# EAGLE design BOB v0.6 (EAGLE 6.1)

## Sheet 1 of 2: Pi Cam Daughterboard
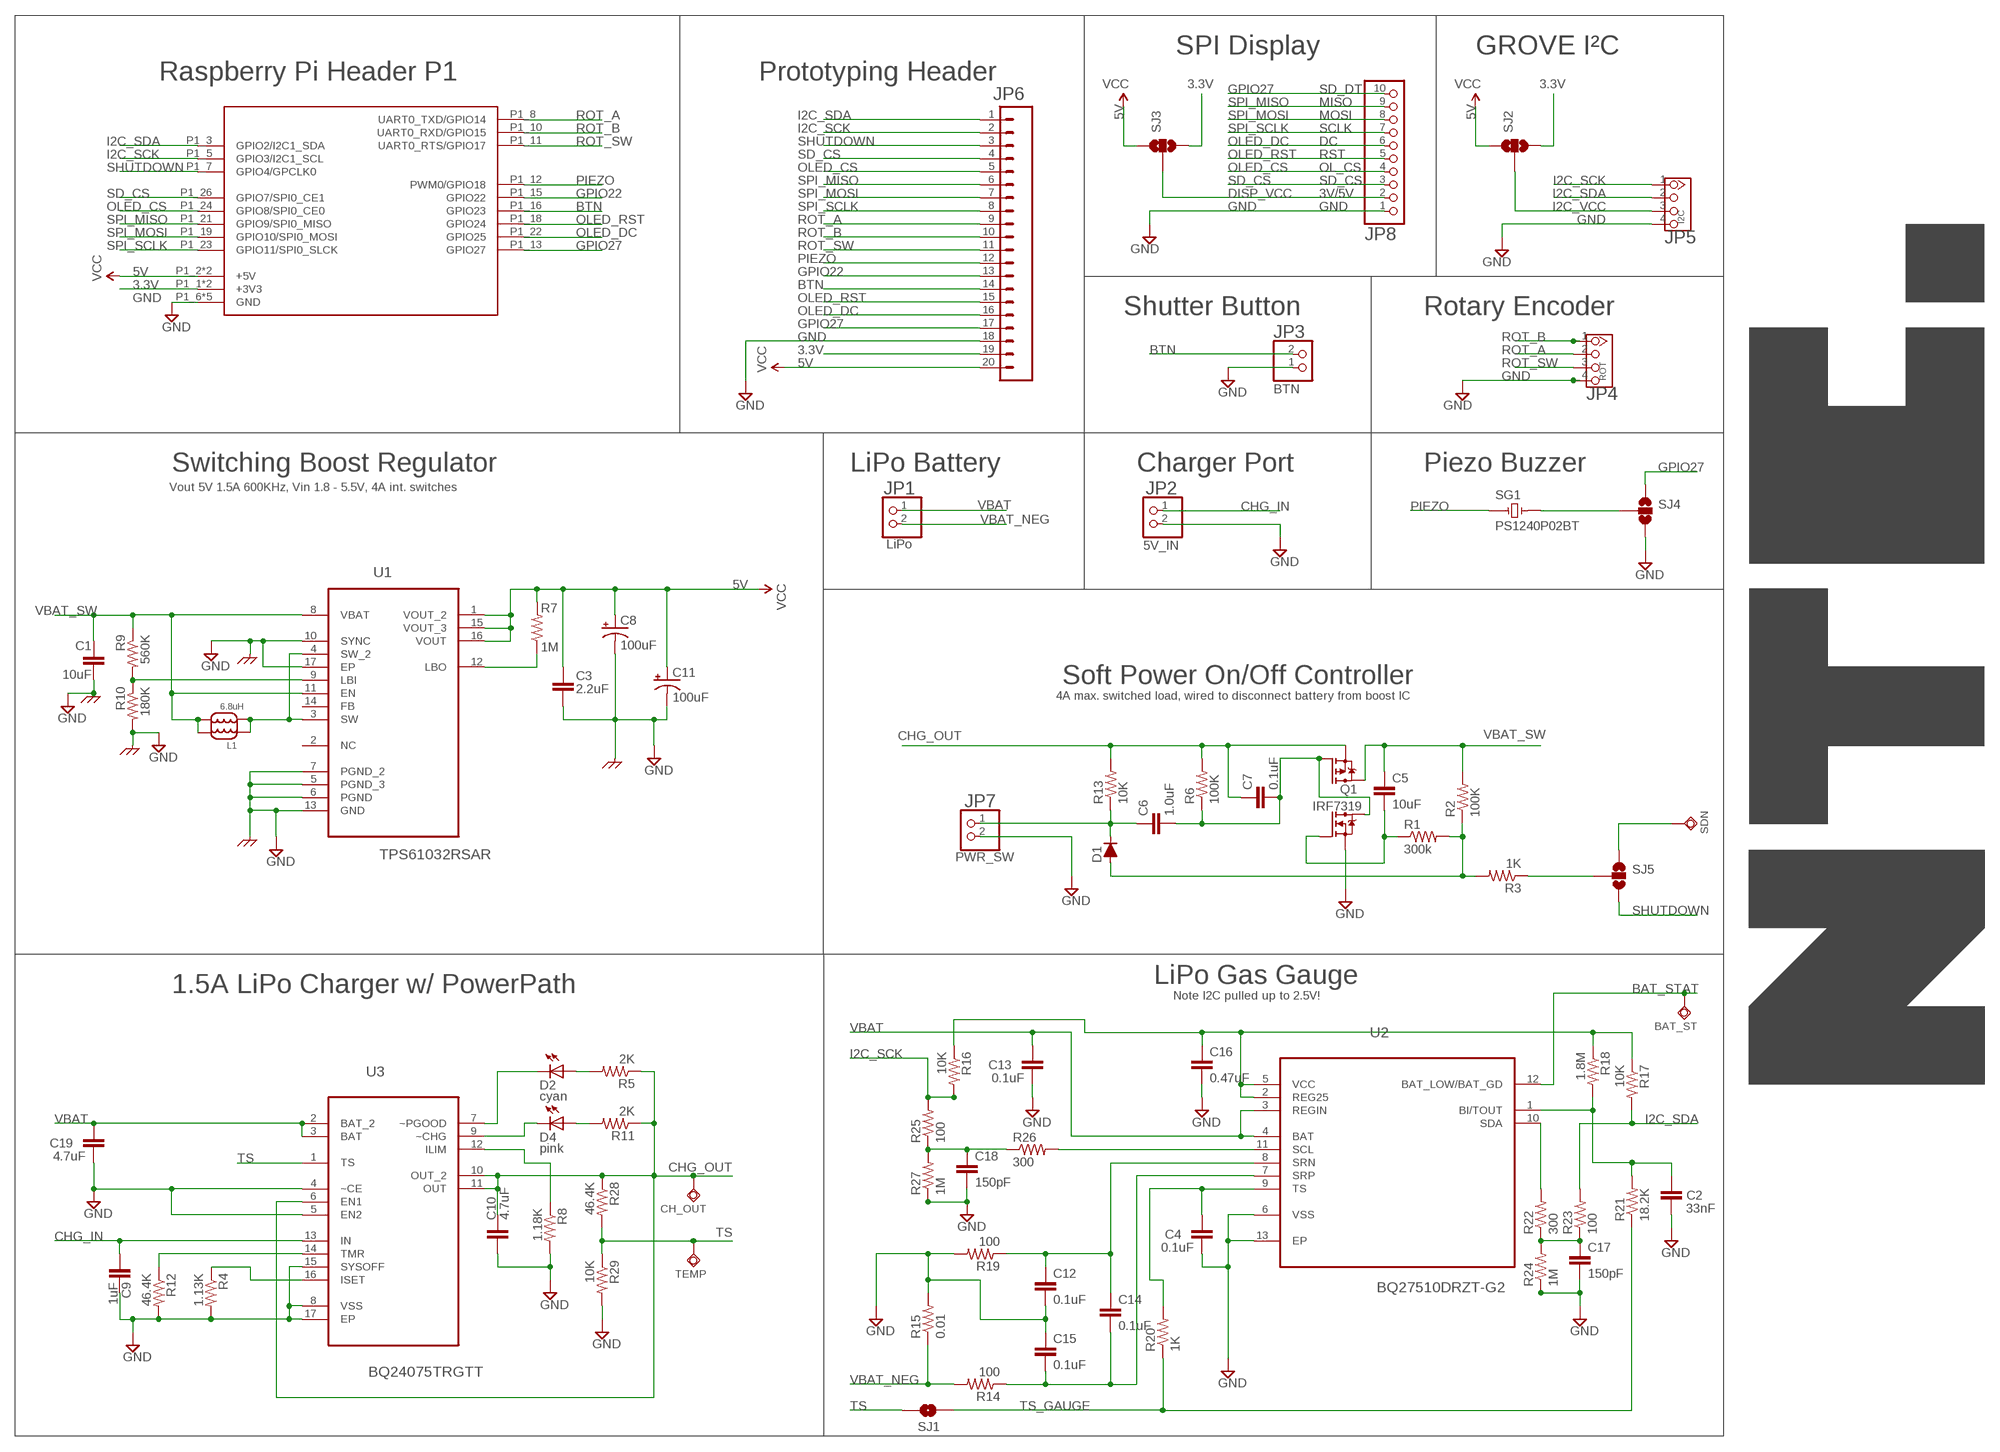
[diagram p0: schematic, sheet 1]

### Parts
BAT_ST  TP1.2  [TP_1.2]
C1  10uF  CAP1206  [1206]
C2  33nF  CAP0603-CAP  [0603-CAP]
C3  2.2uF  CAP0603  [0603]
C4  0.1uF  CAP0603-CAP  [0603-CAP]
C5  10uF  10UF-6.3V-20%(0603)  [0603-CAP]
C6  1.0uF  1.0UF-16V-10%(0603)  [0603-CAP]
C7  0.1uF  0.1UF-25V-5%(0603)  [0603-CAP]
C8  100uF  CAP_POL1206  [EIA3216]
C9  1uF  CAP0603-CAP  [0603-CAP]
C10  4.7uF  CAP0603-CAP  [0603-CAP]
C11  100uF  CAP_POL1206  [EIA3216]
C12  0.1uF  CAP0603-CAP  [0603-CAP]
C13  0.1uF  CAP0603-CAP  [0603-CAP]
C14  0.1uF  CAP0603-CAP  [0603-CAP]
C15  0.1uF  CAP0603-CAP  [0603-CAP]
C16  0.47uF  CAP0603-CAP  [0603-CAP]
C17  150pF  CAP0603-CAP  [0603-CAP]
C18  150pF  CAP0603-CAP  [0603-CAP]
C19  4.7uF  CAP0603-CAP  [0603-CAP]
CH_OUT  TP1.2  [TP_1.2]
D1  D-FILL-SMB  [SMB]
D2  cyan  LED0603  [LED-0603]
D4  pink  LED0603  [LED-0603]
JP1  LiPo  JST_2PIN-THM  [JST-PH-2-THM]
JP2  5V_IN  JST_2PIN-THM  [JST-PH-2-THM]
JP3  BTN  JST_2PIN-THM  [JST-PH-2-THM]
JP4  ROT  TWIG-4P-2.0-2.0  [4P-2.0]
JP5  I2C  TWIG-4P-2.0-2.0  [4P-2.0]
JP6  M20LOCK_LONGPADS  [1X20_LOCK_LONGPADS]
JP7  PWR_SW  JST_2PIN-THM  [JST-PH-2-THM]
JP8  PINHD-1X10  [1X10-BIG]
L1  6.8uH  SUMIDA_CDRH124CDRH124NP-6R8MC  [SUMIDA_CDRH124]
PICAM_SHIELD  PICAM_RPI-B-PICAM  [PICAM_RPI-B-PICAM]
Q1  IRF7319  IRF7319Q  [SO08-IRF]
R1  300k  RESISTOR0603-RES  [0603-RES]
R2  100K  RESISTOR0603-RES  [0603-RES]
R3  1K  RESISTOR0603-RES  [0603-RES]
R4  1.13K  RESISTOR0603-RES  [0603-RES]
R5  2K  RESISTOR0603-RES  [0603-RES]
R6  100K  RESISTOR0603-RES  [0603-RES]
R7  1M  RESISTOR0603-RES  [0603-RES]
R8  1.18K  RESISTOR0603-RES  [0603-RES]
R9  560K  RESISTOR0603-RES  [0603-RES]
R10  180K  RESISTOR0603-RES  [0603-RES]
R11  2K  RESISTOR0603-RES  [0603-RES]
R12  46.4K  RESISTOR0603-RES  [0603-RES]
R13  10K  RESISTOR0603-RES  [0603-RES]
R14  100  RESISTOR0603-RES  [0603-RES]
R15  0.01  RESISTOR0603-RES  [0603-RES]
R16  10K  RESISTOR0603-RES  [0603-RES]
R17  10K  RESISTOR0603-RES  [0603-RES]
R18  1.8M  RESISTOR0603-RES  [0603-RES]
R19  100  RESISTOR0603-RES  [0603-RES]
R20  1K  RESISTOR0603-RES  [0603-RES]
R21  18.2K  RESISTOR0603-RES  [0603-RES]
R22  300  RESISTOR0603-RES  [0603-RES]
R23  100  RESISTOR0603-RES  [0603-RES]
R24  1M  RESISTOR0603-RES  [0603-RES]
R25  100  RESISTOR0603-RES  [0603-RES]
R26  300  RESISTOR0603-RES  [0603-RES]
R27  1M  RESISTOR0603-RES  [0603-RES]
R28  46.4K  RESISTOR0603-RES  [0603-RES]
R29  10K  RESISTOR0603-RES  [0603-RES]
SDN  TP1.2  [TP_1.2]
SG1  PS1240P02BT  [PS1240]
SJ1  SOLDERJUMPER-OLDTRACE  [SJ_2S-TRACE]
SJ2  SOLDERJUMPER_2WAYPASTE1&2  [SJ_3_PASTE1&2]
SJ3  SOLDERJUMPER_2WAYPASTE2&3  [SJ_3_PASTE2&3]
SJ4  SOLDERJUMPER_2WAYPASTE1&2  [SJ_3_PASTE1&2]
SJ5  SOLDERJUMPER_2WAYPASTE2&3  [SJ_3_PASTE2&3]
TEMP  TP1.2  [TP_1.2]
U1  TPS61032RSAR  [QFN65P400X400X100-17N]
U2  BQ27510DRZT-G2  [SON40P400X250X100-13N]
U3  BQ24075TRGTT  [QFN50P300X300X100-17N]

### Nets
3.3V: JP6.19 PICAM_SHIELD.P1_1(+3V3) PICAM_SHIELD.P1_17(+3V3) SJ2.3 SJ3.3
5V: C3.1 C8.A(+) C11.A(+) JP6.20 PICAM_SHIELD.P1_2(+5V) PICAM_SHIELD.P1_4(+5V) R7.2 SJ2.1 SJ3.1 U1.1(VOUT_2) U1.15(VOUT_3) U1.16(VOUT) ; supply symbol labelled VCC
BAT_STAT: BAT_ST.1(TP) U2.12(BAT_LOW/BAT_GD)
BTN: JP3.2 JP6.14 PICAM_SHIELD.P1_16(GPIO23)
CHG_IN: C9.1 JP2.1 U3.13(IN)
CHG_OUT: C7.1 C10.1 CH_OUT.1(TP) Q1.3(P-S2) R5.1 R6.2 R11.1 R13.2 R28.1 U3.6(EN1) U3.10(OUT_2) U3.11(OUT)
DISP_VCC: JP8.2 SJ3.2
GND: C1.2 C2.2 C3.2 C4.2 C8.C(-) C9.2 C10.2 C11.C(-) C12.2 C13.2 C15.1 C16.2 C17.2 C18.2 C19.2 JP2.2 JP3.1 JP4.4 JP5.4 JP6.18 JP7.2 JP8.1 PICAM_SHIELD.P1_6(GND) PICAM_SHIELD.P1_9(GND) PICAM_SHIELD.P1_14(GND) PICAM_SHIELD.P1_20(GND) PICAM_SHIELD.P1_25(GND) Q1.1(N-S1) R4.2 R8.2 R10.2 R12.2 R15.2 R19.2 R24.1 R27.1 R29.2 SJ4.3 U1.5(PGND_3) U1.6(PGND) U1.7(PGND_2) U1.10(SYNC) U1.13(GND) U1.17(EP) U2.6(VSS) U2.13(EP) U3.4(~CE) U3.5(EN2) U3.8(VSS) U3.15(SYSOFF) U3.17(EP)
GPIO22: JP6.13 PICAM_SHIELD.P1_15(GPIO22)
GPIO27: JP6.17 JP8.10 PICAM_SHIELD.P1_13(GPIO27) SJ4.1
I2C_SCK: JP5.1 JP6.2 PICAM_SHIELD.P1_5(GPIO3/I2C1_SCL) R16.2 R25.2
I2C_SDA: JP5.2 JP6.1 PICAM_SHIELD.P1_3(GPIO2/I2C1_SDA) R17.2 R23.2
I2C_VCC: JP5.3 SJ2.2
L1: L1.P$3 L1.P$4 U1.3(SW) U1.4(SW_2)
N$1: C6.1 D1.1(C) JP7.1 R13.1
N$2: C2.1 R18.2 R21.2 U2.1(BI/TOUT)
N$4: C17.1 R22.1 R23.1 R24.2
N$5: D4.C U3.9(~CHG)
N$6: R7.1 U1.12(LBO)
N$7: R9.2 R10.1 U1.9(LBI)
N$8: R12.1 U3.14(TMR)
N$9: C5.2 Q1.2(N-G1) R1.1
N$10: R4.1 U3.16(ISET)
N$11: D4.A R11.2
N$12: D2.C U3.7(~PGOOD)
N$13: D2.A R5.2
N$14: C6.2 C7.2 Q1.4(P-G2) Q1.7(N-D1) Q1.8(N-D1) R6.1
N$15: D1.2(A) R1.2 R2.1 R3.2
N$16: R22.2 U2.10(SDA)
N$17: C18.1 R25.1 R26.1 R27.2
N$19: R8.1 U3.12(ILIM)
N$20: R26.2 U2.11(SCL)
N$21: C4.1 R20.2 U2.9(TS)
N$23: SG1.P$2 SJ4.2
N$24: C16.1 R16.1 R17.1 R18.1 U2.2(REG25) U2.5(VCC)
N$29: R3.1 SJ5.2
N$34: SDN.1(TP) SJ5.1
OLED_CS: JP6.5 JP8.4 PICAM_SHIELD.P1_24(GPIO8/SPI0_CE0)
OLED_DC: JP6.16 JP8.6 PICAM_SHIELD.P1_22(GPIO25)
OLED_RST: JP6.15 JP8.5 PICAM_SHIELD.P1_18(GPIO24)
PIEZO: JP6.12 PICAM_SHIELD.P1_12(PWM0/GPIO18) SG1.P$1
ROT_A: JP4.2 JP6.9 PICAM_SHIELD.P1_8(UART0_TXD/GPIO14)
ROT_B: JP4.1 JP6.10 PICAM_SHIELD.P1_10(UART0_RXD/GPIO15)
ROT_SW: JP4.3 JP6.11 PICAM_SHIELD.P1_11(UART0_RTS/GPIO17)
SD_CS: JP6.4 JP8.3 PICAM_SHIELD.P1_26(GPIO7/SPI0_CE1)
SHUTDOWN: JP6.3 PICAM_SHIELD.P1_7(GPIO4/GPCLK0) SJ5.3
SPI_MISO: JP6.6 JP8.9 PICAM_SHIELD.P1_21(GPIO9/SPI0_MISO)
SPI_MOSI: JP6.7 JP8.8 PICAM_SHIELD.P1_19(GPIO10/SPI0_MOSI)
SPI_SCLK: JP6.8 JP8.7 PICAM_SHIELD.P1_23(GPIO11/SPI0_SLCK)
SRN: C12.1 C14.1 R19.1 U2.8(SRN)
SRP: C14.2 C15.2 R14.1 U2.7(SRP)
TS: R28.2 R29.1 SJ1.1 TEMP.1(TP) U3.1(TS)
TS_GAUGE: R20.1 R21.1 SJ1.2
VBAT: C13.1 C19.1 JP1.1 U2.3(REGIN) U2.4(BAT) U3.2(BAT_2) U3.3(BAT)
VBAT_NEG: JP1.2 R14.2 R15.1
VBAT_SW: C1.1 C5.1 L1.P$1 L1.P$2 Q1.5(P-D2) Q1.6(P-D2) R2.2 R9.1 U1.8(VBAT) U1.11(EN)
Unconnected: U1.2(NC) U1.14(FB)

### Notes on the sheet
- SPI Display | GROVE I²C
- Raspberry Pi Header P1 | Prototyping Header
- SD_DT
- MISO
- MOSI
- SCLK
- DC
- RST
- OL_CS
- SD_CS
- 3V/5V
- GND
- Shutter Button | Rotary Encoder
- Switching Boost Regulator | LiPo Battery | Charger Port | Piezo Buzzer
- Vout 5V 1.5A 600KHz, Vin 1.8 - 5.5V, 4A int. switches
- Soft Power On/Off Controller
- 4A max. switched load, wired to disconnect battery from boost IC
- LiPo Gas Gauge
- 1.5A LiPo Charger w/ PowerPath
- Note I2C pulled up to 2.5V!

## Sheet 2 of 2

## Library data of the parts
BAT_ST CH_OUT SDN TEMP = TESTPAD:TP: Testpad hole 0.8mm (32mil)
C1 C3 = CH_passive:CAP: Capacitor Standard 0603 ceramic capacitor, and 0.1" leaded capacitor.
C2 C4 C9 C10 C13 C19 = SparkFun:CAP: Capacitor Standard 0603 ceramic capacitor, and 0.1" leaded capacitor.
C5 = SparkFun-Capacitors:10UF-6.3V-20%(0603): CAP-11015; PROD_ID: CAP-11015
C6 = SparkFun-Capacitors:1.0UF-16V-10%(0603): CAP-00868; PROD_ID: CAP-00868
C7 = SparkFun-Capacitors:0.1UF-25V-5%(0603): CAP-08604; PROD_ID: CAP-08604
C8 C11 = SparkFun-Capacitors:CAP_POL: Capacitor Polarized These are standard SMD and PTH capacitors. Normally 10uF, 47uF, and 100uF in electrolytic and tantalum varieties. Always verify the external diameter of the through hole cap, it varies with capacity, voltage, and manufacturer. The EIA devices should be standard.
C12 C14-C18 = SparkFun-Capacitors:CAP: Capacitor Standard 0603 ceramic capacitor, and 0.1" leaded capacitor.
D1 = semicon-smd-ipc:D-FILL-: DIODE filled
D2 D4 = SparkFun:LED: LEDs Standard schematic elements and footprints for 5mm, 3mm, 1206, and 0603 sized LEDs. 5mm - Spark Fun Electronics SKU : COM-00529 (and others)
JP1-JP3 JP7 = PiCam:JST_2PIN: JST 2-Pin Connectors of various flavors SMT-RA (S2B-PH-SM4) 4UConnector #17311 SMT (B2B-PH-SM4) THM-RA (S2B-PH) THM (B2B-PH)
JP4 JP5 = Connector :TWIG-4P-2.0
JP6 = SparkFun-Connectors:M20: 1x20 .1" header This is just like the LOCK variant in that the holes are staggared by 5 mil, but except for the last two holes. They are not altered from the "standard" footprint layout. This is used for a special purpose on the layout of our Graphic LCD Backpack. Make sure you want to use this device before selecting it for you project!
JP8 = adafruit:PINHD-1X10: Pin header 1x10 0.1" spacing With round pins
L1 = PiCam_V0.5:SUMIDA_CDRH124: Sumida CDRH124-xx SMD Power Inductor 12.3 x 12.3 x 4.5mm Max. RoHS Compliant Magnetically Shielded Ferrite Drum Core; INDUCTANCE: 6.8uH
PICAM_SHIELD = PiCam_V0.5:PICAM_RPI-B-PICAM: Second revision of the Model 2 board including the P5 and P6 headers. Mounting holes have been added. Choose the "SHIELD" variant for a predefined Dimension layer and drilling holes. Theres also a "SHIELD" variant for the Model A without a RJ45 connector.
Q1 = PiCam:IRF7319
R1-R3 R6 R13 = SparkFun-Passives:RESISTOR: Resistor Basic schematic elements and footprints for 0603, 1206, and PTH resistors.
R4 R5 R7-R12 R14 R16-R19 R28 R29 = SparkFun:RESISTOR: Resistor Basic schematic elements and footprints for 0603, 1206, and PTH resistors.
R15 = SparkFun-Passives:RESISTOR: Resistor Basic schematic elements and footprints for 0603, 1206, and PTH resistors.; PRECISION: 1%; WATT: 1/4W
R20-R27 = SparkFun-Resistors:RESISTOR: Resistor Basic schematic elements and footprints for 0603, 1206, and PTH resistors.; PRECISION: 1%; WATT: 1/4W
SG1 = TDK-U:PS1240P02BT: Buzzer 70dB/3V
SJ1 = SparkFun-Passives:SOLDERJUMPER-OLD: Solder Jumper Standard SMD solder jumper. Used to automate production. Two varients : Normally Open and Normally Closed are the same, but have different paste layers. NC will have a large amount of paste and should jumper during reflow.
SJ2-SJ5 = SparkFun-Passives:SOLDERJUMPER_2WAY: Solder Jumper 2 way solder jumper
U1 = Texas Instruments_By_element14_Batch_1:TPS61032RSAR: SYNCHRONOUS BOOST CONVERTER; MPN: TPS61032RSAR; OC_FARNELL: 1743713; OC_NEWARK: 90H4861; PACKAGE: QFN-16; SUPPLIER: Texas Instruments
U2 = Texas Instruments_By_element14_Batch_1:BQ27510DRZT-G2: System-Side Impedance Track Fuel Gauge; MPN: BQ27510DRZT-G2; OC_FARNELL: -; OC_NEWARK: 99R9913; PACKAGE: SON-12; SUPPLIER: Texas Instruments
U3 = Texas Instruments_By_element14_Batch_1:BQ24075TRGTT: 1.5A USB-Friendly Li-Ion Battery Charger and Power-Path Management IC; MPN: BQ24075TRGTT; OC_FARNELL: -; OC_NEWARK: 63R9856; PACKAGE: QFN-16; SUPPLIER: Texas Instruments

## Net classes
0 default: width 0.254 mm

## Board
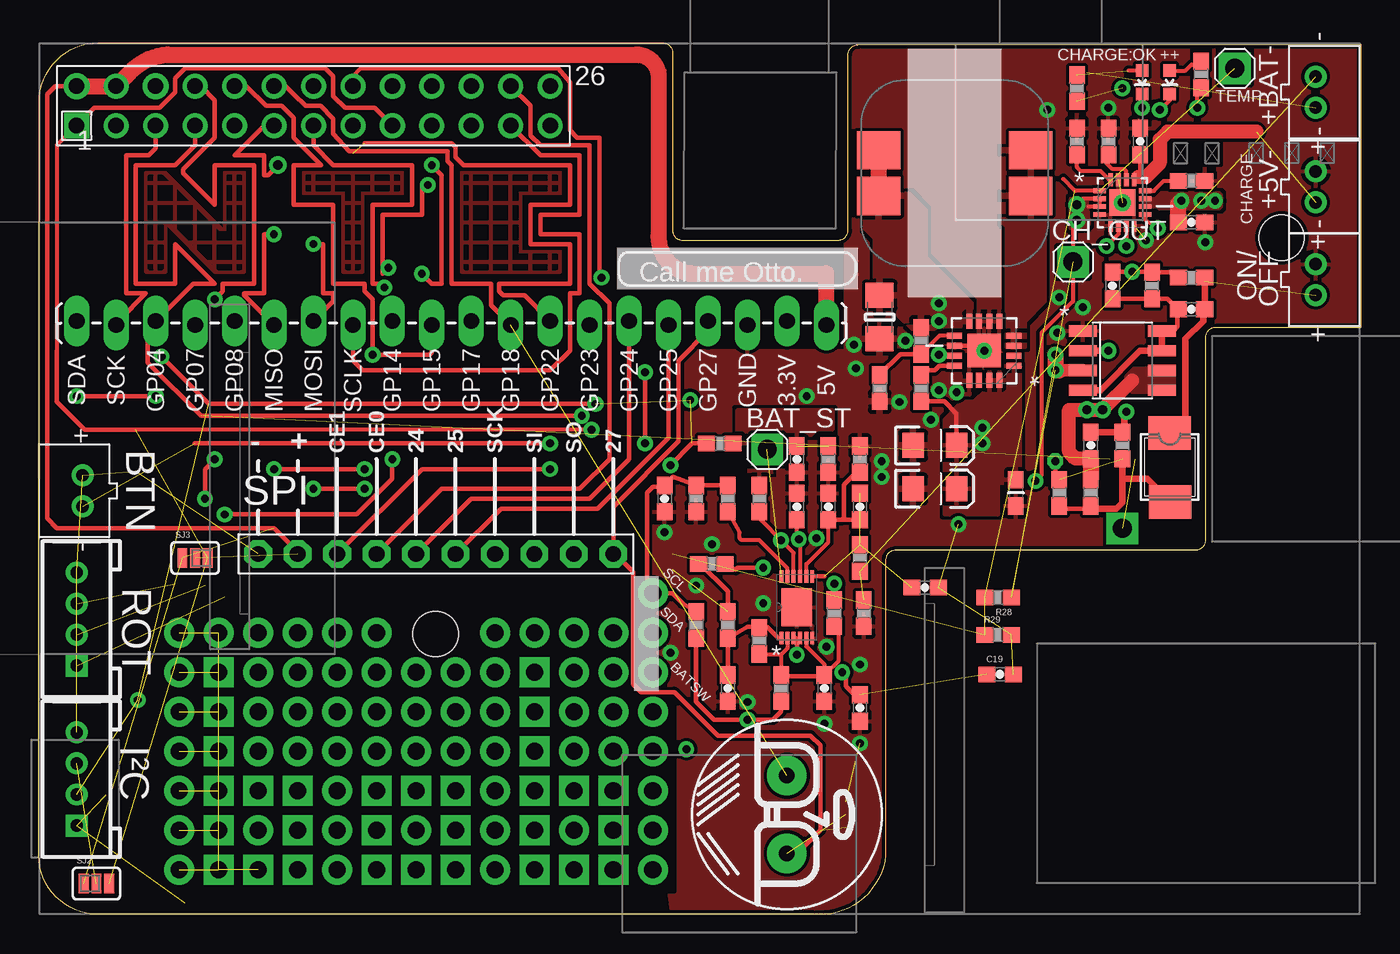
[diagram p1: board, top side]
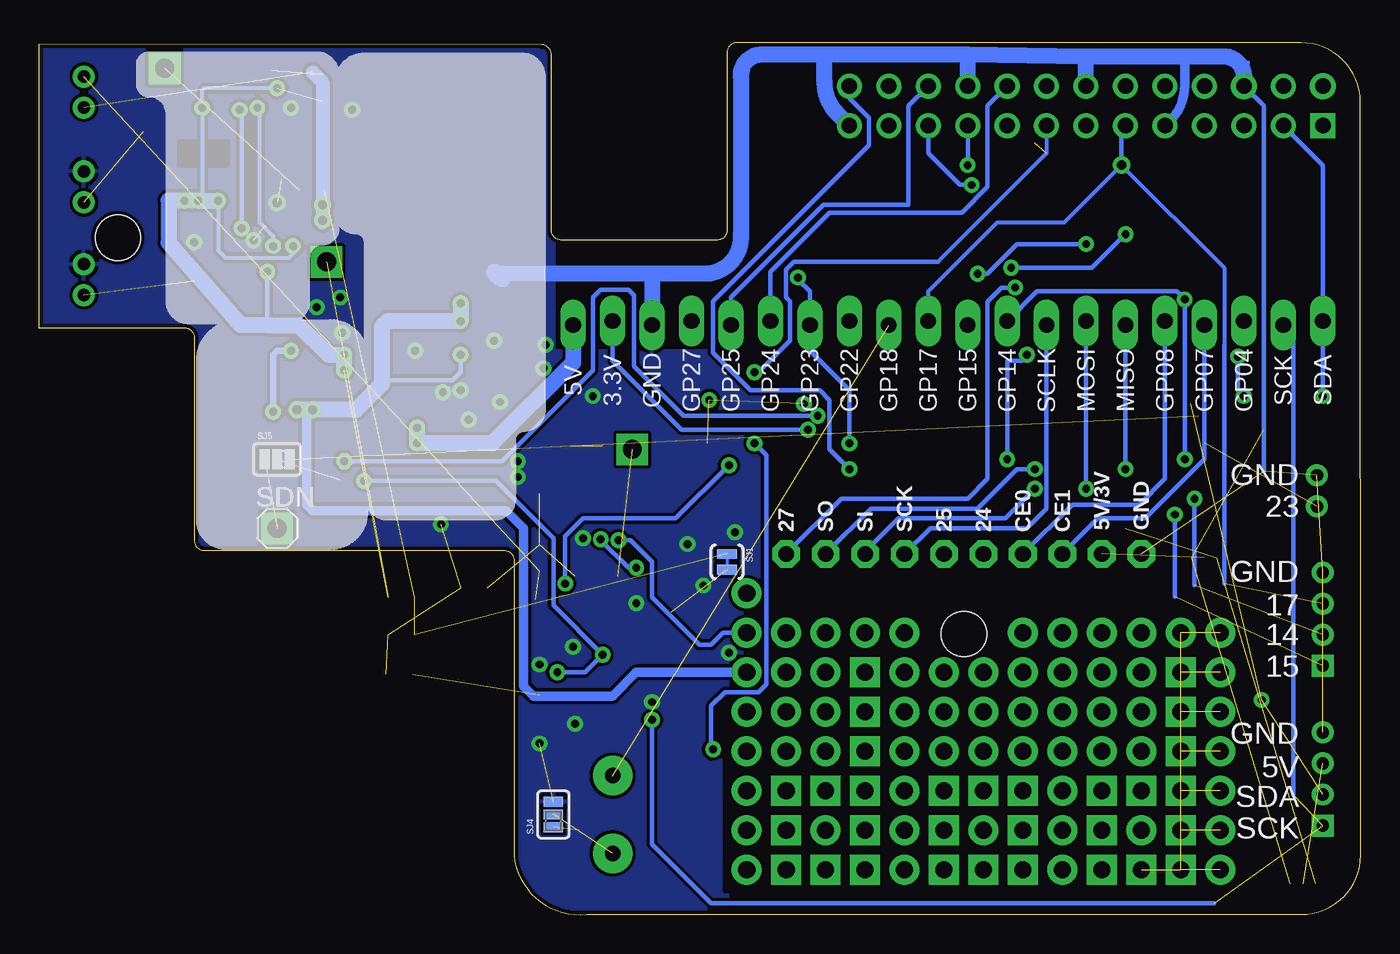
[diagram p2: board, bottom side, seen from below]

Size 85.09 x 56.1 mm. Coordinates in mm from the lower left corner, seen from the top.
Copper layers (1*16): Top 0.035mm / dielectric 1.5mm / Bottom 0.035mm
Design rules: minimum track width 8mil, minimum drill 20mil, track to track 8mil, track to pad 8mil, pad to pad 8mil, via to via 8mil, smd to smd 8mil, copper to edge 10mil, drill to drill 8mil, minimum pad ring 12mil, minimum via ring 10mil, stop-mask expansion 4mil, vias tented up to drill 25mil, thermal gap 10mil
tKeepout: area 7.8,1.5 to 40.9,19.5
bKeepout: area 7.8,1.5 to 40.9,19.5
tRestrict: area 72.9,48.2 to 74.1,49.8; area 75,48.2 to 76.1,49.8; area 7.8,1.5 to 40.9,19.5
bRestrict: area 72.9,48.2 to 74.1,49.8; area 75,48.2 to 76.1,49.8; area 7.8,1.5 to 40.9,19.5
vRestrict: area 7.8,1.5 to 40.9,19.5

### Footprints (pad centres in the part's own frame; a part is rotated, then mirrored left to right if it is on the bottom)
TP_1.2 = drill 1.219 pad 2.032 square: 1 0,0
1206 = smd 1.6 x 1.8: 1 -1.4,0; 2 1.4,0
0603-CAP = smd 1.1 x 1: 1 -0.85,0; 2 0.85,0
0603 = smd 1.1 x 1: 1 -0.85,0; 2 0.85,0
EIA3216 = smd 1.4 x 1.6: A 1.4,0; C -1.4,0
SPARKFUN-CAPACITORS_0603-CAP = smd 1.1 x 1: 1 -0.85,0; 2 0.85,0
SMB = smd 2.159 x 2.743: 1 -2.311,-0.127; 2 2.108,-0.102
SPARKFUN_LED-0603 = smd 0.8 x 0.8: A 0,-0.75; C 0,0.75
LED-0603 = smd 0.8 x 0.8: A 0,-0.75; C 0,0.75
JST-PH-2-THM = drill 0.8 pad 1.422: 1 1,0; 2 -1,0
4P-2.0 = drill 0.8 pad 1.27 square: 1 -3,0 | drill 0.8 pad 1.27: 2 -1,0; 3 1,0; 4 3,0
1X20_LOCK_LONGPADS = drill 1.016 long: 1 0,0.127; 2 2.54,-0.127; 3 5.08,0.127; 4 7.62,-0.127; 5 10.16,0.127; 6 12.7,-0.127; 7 15.24,0.127; 8 17.78,-0.127; 9 20.32,0.127; 10 22.86,-0.127; 11 25.4,0.127; 12 27.94,-0.127; 13 30.48,0.127; 14 33.02,-0.127; 15 35.56,0.127; 16 38.1,-0.127; 17 40.64,0.127; 18 43.18,-0.127; 19 45.72,0.127; 20 48.26,-0.127
1X10-BIG = drill 1.016 pad 1.778 octagon: 1 -11.43,0; 2 -8.89,0; 3 -6.35,0; 4 -3.81,0; 5 -1.27,0; 6 1.27,0; 7 3.81,0; 8 6.35,0; 9 8.89,0; 10 11.43,0
SUMIDA_CDRH124 = smd 2.45 x 2.8: P$1 -1.475,4.9; P$2 1.475,4.9; P$3 -1.475,-4.9; P$4 1.475,-4.9
PICAM_RPI-B-PICAM = drill 1 square: P1_1 -36.83,20.32 | drill 1 pad 1.676: P1_2 -36.83,22.86; P1_6 -31.75,22.86 | drill 1: P1_3 -34.29,20.32; P1_4 -34.29,22.86; P1_5 -31.75,20.32; P1_7 -29.21,20.32; P1_8 -29.21,22.86; P1_9 -26.67,20.32; P1_10 -26.67,22.86; P1_11 -24.13,20.32; P1_12 -24.13,22.86; P1_13 -21.59,20.32; P1_14 -21.59,22.86; P1_15 -19.05,20.32; P1_16 -19.05,22.86; P1_17 -16.51,20.32; P1_18 -16.51,22.86; P1_19 -13.97,20.32; P1_20 -13.97,22.86; P1_21 -11.43,20.32; P1_22 -11.43,22.86; P1_23 -8.89,20.32; P1_24 -8.89,22.86; P1_25 -6.35,20.32; P1_26 -6.35,22.86 | hole 2.9: -13.73,-12.4; 40.74,13.11
SO08-IRF = smd 0.72 x 1.78: 1 -1.905,-2.543; 2 -0.635,-2.543; 3 0.635,-2.543; 4 1.905,-2.543; 5 1.905,2.543; 6 0.635,2.543; 7 -0.635,2.543; 8 -1.905,2.543
0603-RES = smd 1.1 x 1: 1 -0.85,0; 2 0.85,0
PS12 = drill 1 pad 2.54: P$1 -2.5,0; P$2 2.5,0
SJ_2S-TRACE = smd 0.635 x 1.27: 1 -0.508,0; 2 0.508,0
SJ_3_PASTE1&2 = smd 0.635 x 1.27: 1 -0.813,0; 2 0,0; 3 0.813,0
SJ_3_PASTE2&3 = smd 0.635 x 1.27: 1 -0.813,0; 2 0,0; 3 0.813,0
QFN65P400X400X100-17N = smd 0.965 x 0.381: 1 -1.905,0.965; 2 -1.905,0.33; 3 -1.905,-0.33; 4 -1.905,-0.965; 9 1.905,-0.965; 10 1.905,-0.33; 11 1.905,0.33; 12 1.905,0.965 | smd 0.381 x 0.965: 5 -0.965,-1.905; 6 -0.33,-1.905; 7 0.33,-1.905; 8 0.965,-1.905; 13 0.965,1.905; 14 0.33,1.905; 15 -0.33,1.905; 16 -0.965,1.905 | smd 2.159 x 2.159: 17 0,0
SON40P400X250X100-13N = smd 0.813 x 0.254: 1 -1.981,0.991; 2 -1.981,0.61; 3 -1.981,0.203; 4 -1.981,-0.203; 5 -1.981,-0.61; 6 -1.981,-0.991; 7 1.981,-0.991; 8 1.981,-0.61; 9 1.981,-0.203; 10 1.981,0.203; 11 1.981,0.61; 12 1.981,0.991 | smd 2.438 x 1.956: 13 0,0
QFN50P300X300X100-17N = smd 0.813 x 0.305: 1 -1.473,0.762; 2 -1.473,0.254; 3 -1.473,-0.254; 4 -1.473,-0.762; 9 1.473,-0.762; 10 1.473,-0.254; 11 1.473,0.254; 12 1.473,0.762 | smd 0.305 x 0.813: 5 -0.762,-1.473; 6 -0.254,-1.473; 7 0.254,-1.473; 8 0.762,-1.473; 13 0.762,1.473; 14 0.254,1.473; 15 -0.254,1.473; 16 -0.762,1.473 | smd 1.702 x 1.702: 17 0,0

### Placement (x,y rotation side)
BAT_ST  46.89,29.94 0 top
C1  54.13,38.45 270 top
C2  44.35,14.58 270 top
C3  62.89,27.15 270 top
C4  48.79,26.26 90 top
C5  67.71,30.2 90 top
C6  74.19,38.96 180 top
C7  69.11,40.48 270 top
C8  57.68,27.4 0 top
C9  70.89,49.75 90 top
C10  74.19,44.55 0 top
C11  57.68,30.2 0 top
C12  0.1uF  [SPARKFUN-CAPACITORS_0603-CAP]  50.82,26.26 90 top
C13  0.1uF  [SPARKFUN-CAPACITORS_0603-CAP]  52.86,13.31 270 top
C14  0.1uF  [SPARKFUN-CAPACITORS_0603-CAP]  52.86,26.26 90 top
C15  0.1uF  [SPARKFUN-CAPACITORS_0603-CAP]  57.05,21.05 180 top
C16  0.47uF  [SPARKFUN-CAPACITORS_0603-CAP]  50.57,14.58 270 top
C17  150pF  [SPARKFUN-CAPACITORS_0603-CAP]  48.79,29.31 270 top
C18  150pF  [SPARKFUN-CAPACITORS_0603-CAP]  40.28,26.77 270 top
C19  61.87,15.46 0 top
CH_OUT  66.57,42.01 0 top
D1  72.92,28.67 270 top
D2  cyan  [SPARKFUN_LED-0603]  71.02,53.56 180 top
D4  72.79,53.56 180 top
JP1  82.19,52.93 270 top
JP2  82.19,46.83 270 top
JP3  2.82,27.28 90 top
JP4  2.44,19.02 90 top
JP5  2.44,8.73 90 top
JP6  2.44,38.07 0 top
JP7  82.19,40.86 270 top
JP8  25.55,23.21 0 top
L1  58.95,47.72 90 top
PICAM_SHIELD  39.27,30.45 0 top
Q1  69.75,35.66 270 top
R1  69.75,30.2 270 top
R2  67.71,27.15 90 top
R3  65.68,27.15 270 top
R4  66.83,49.75 90 top
R5  66.83,53.18 90 top
R6  71.65,40.48 90 top
R7  56.79,33.88 270 top
R8  74.19,47.21 0 top
R9  56.79,36.93 270 top
R10  54.13,33.88 270 top
R11  74.83,54.07 90 top
R12  68.86,49.75 90 top
R13  74.19,40.99 180 top
R14  52.86,22.96 270 top
R15  53.11,19.4 270 top
R16  47.78,14.58 270 top
R17  51.2,19.4 90 top
R18  46.38,17.62 90 top
R19  52.86,29.31 90 top
R20  43.33,22.58 0 top
R21  44.35,18.64 270 top
R22  46.38,26.77 270 top
R23  43.84,30.32 180 top
R24  50.82,29.31 90 top
R25  42.31,18.64 270 top
R26  44.35,26.77 270 top
R27  42.31,26.77 90 top
R28  61.75,20.42 180 top
R29  61.75,18 0 top
SDN  69.75,24.86 0 bottom
SG1  PS1240P02BT  [PS12]  48.16,6.45 270 top
SJ1  40.79,22.7 270 bottom
SJ2  3.71,2 0 top
SJ3  10.06,22.96 0 top
SJ4  51.97,6.45 90 bottom
SJ5  69.75,29.31 0 bottom
TEMP  76.99,54.45 0 top
U1  60.86,36.29 180 top
U2  48.79,19.78 90 top
U3  69.75,45.82 0 top

### Tracks (layer width: path | path; a pad name or v marks a point on that pad's centre or on a via)
3.3V  (via drill 0.51)  (2 unrouted)
  Top 0.254: 1.17,36.29 1.17,49.5 PICAM_SHIELD.P1_1 | v35.58,31.21 6.25,31.21
  Top 0.305: 1.17,36.29 1.17,32.99 2.94,31.21 6.25,31.21 | PICAM_SHIELD.P1_17 21.61,51.91 19.71,51.91 18.95,52.68 18.95,53.95 18.44,54.45 9.42,54.45 8.79,53.82 8.79,52.93 7.77,51.91 3.58,51.91 PICAM_SHIELD.P1_1
  Bottom 0.279: v35.58,31.21 43.71,31.21 48.16,35.66 JP6.19
5V  (via drill 0.51)  (2 unrouted)
  Top 0.305: R7.2 58.28,33.03 59.08,32.23 59.08,30.58 C11.A | 16.66,23.34 15.14,24.86 1.17,24.86 0.53,25.5 0.53,52.8 1.04,53.31 PICAM_SHIELD.P1_2
  Top 1.016: PICAM_SHIELD.P1_2 PICAM_SHIELD.P1_4 5.79,54.13 arc-45 8.29,55.34 38.47,55.34 arc-90 39.9,53.91 39.9,43.86 arc90 42.01,41.25 50.7,41.25 JP6.20
  Bottom 1.016: JP6.20 50.7,35.53 55.9,30.32 v60.73,30.32 v60.73,31.34
  pour Top: 61.11,35.02 61.75,35.02 62,35.28 63.14,35.28 63.14,27.78 61.75,27.78 61.75,25.75 58.32,25.75 58.32,31.85 59.46,32.99 60.22,32.99 60.98,33.75 60.98,34.9
BAT_STAT  (1 unrouted)
BTN  (via drill 0.5, 0.51)  (1 unrouted)
  Top 0.254: PICAM_SHIELD.P1_16 20.22,53.95 20.72,54.45 21.49,54.45
  Top 0.279: 21.49,54.45 33.42,54.45 34.19,53.56 34.19,50.47 34.64,50.01 36.09,50.01 36.09,40.99 v36.22,40.99
  Top 0.305: v32.92,30.32 10.04,30.32
  Bottom 0.305: v32.92,30.32 32.92,33.75 35.46,36.29 JP6.14 35.46,40.1 36.22,40.86 v36.22,40.99
CHG_IN  (1 unrouted)
  Top 0.254: 70.76,47.47 70.56,47.47 U3.13 70.89,47.67 C9.1
  Top 0.914: 78.38,50.39 72.67,50.39 72.16,49.88 72.16,48.36 71.27,47.47 70.76,47.47
CHG_OUT  (via drill 0.51)  (3 unrouted)
  Top 0.254: U3.6 69.49,43.79 v68.73,43.02 | v74.57,51.91 74.57,53.18 74.87,53.18 R11.1
  Top 0.305: 71.69,41.33 R6.2 71.61,41.37 v70.38,41.37 69.11,41.37 C7.1 | R13.2 73,41.33 71.69,41.33 | 71.69,41.33 71.65,41.37 71.65,41.5
  Top 0.813: Q1.3 65.68,35.02
  Top 1.016: C10.1 73.34,45.73 v73.56,45.94 | 65.68,35.02 v65.43,35.02 v65.43,36.04
  Bottom 0.254: v73.56,45.94 73.56,42.77 73.05,42.26 68.98,42.26 68.73,42.52 v68.73,43.02 | v69.75,53.18 74.45,53.18 74.57,53.06 v74.57,51.91 74.57,46.2 v74.83,45.94
  Bottom 0.305: v70.38,41.37 70.38,37.94
  Bottom 1.016: v65.43,35.02 v65.43,36.04 66.44,36.04 68.35,37.94 70.38,37.94 72.07,37.94 72.37,38.24 76.73,43.24 76.73,45.94 v74.83,45.94 | 74.7,45.94 v74.83,45.94 | v74.83,45.94 v73.56,45.94
  other vias: 75.72,45.94
  pour Top (no thermals): 71.14,46.07 71.91,46.07 72.29,46.45 75.97,46.45 76.1,46.33 76.1,45.56 75.97,45.44 72.16,45.44 72.03,45.56 71.14,45.56
DISP_VCC  (1 unrouted)
GND  (via drill 0.51, 0.6)  (10 unrouted)
  Top 0.305: U1.10 60.53,36.62 U1.17
  Bottom 0.254: 7.26,54.83 7.69,54.59
  Bottom 0.305: 6.25,28.53 6.25,52.04 PICAM_SHIELD.P1_6
  Bottom 0.61: PICAM_SHIELD.P1_9 12.26,51.11 arc-45 11.33,53.36 11.33,55.22
  Bottom 1.016: PICAM_SHIELD.P1_6 7.52,53.95 arc-30 7.69,54.59 arc-60 8.79,55.22 11.33,55.22 17.68,55.22 | 17.68,55.22 25.3,55.34 | 25.3,55.34 34.5,55.34 | 34.5,55.34 38.63,55.34 arc-90 39.9,53.95 39.9,43.79 arc90 42.06,41.25 45.62,41.25 | 45.62,41.25 JP6.18 | PICAM_SHIELD.P1_14 17.68,55.22 | PICAM_SHIELD.P1_20 25.3,55.34 | PICAM_SHIELD.P1_25 33.65,51.5 arc45 34.5,53.57 34.5,55.34 | 55.27,40.86 55.78,41.25 | 55.78,41.25 55.78,41.37 | 45.62,41.25 55.78,41.25
  other vias: 69.75,45.82 71.27,43.4 65.68,39.72 67.21,39.09 65.56,37.44 75.08,43.28 59.08,33.63 57.94,33.75 60.86,36.29 55.78,36.93 55.4,32.99 52.47,36.67 57.43,31.85 59.21,25.12 64.92,51.79 54.25,28.16 54.25,29.18 49.43,33.37 40.66,16.86 50.57,12.29 52.86,11.02 50.7,17.24 45.62,13.69 40.28,24.61 43.33,23.85 52.6,35.15 46.63,20.04 52.86,16.1 50.06,24.23 68.86,51.91 42.31,21.18
  pour Top (rank 6): 51.97,55.98 84.99,55.98 84.99,37.82 75.21,37.82 74.95,23.59 54.51,23.59 54.51,0.1 40.79,-0.03 38.63,16.86 38.63,36.29 51.97,36.29
  pour Bottom (rank 6): 51.97,55.98 51.97,36.29 38.63,36.29 38.63,16.86 40.79,16.86 40.79,-0.03 54.51,0.1 54.51,23.59 74.95,23.59 75.21,37.82 84.99,37.82 84.99,55.98
  pour Top: 52.6,37.44 55.01,37.44 55.01,34.39 57.17,32.1 57.17,24.86 54.51,24.86 54.51,30.58 52.6,32.48
  pour Bottom: 59.08,37.44 62.13,37.44 62.13,35.66 61.49,35.02 57.3,35.02 56.92,35.4 55.4,35.4 55.4,34.01 56.79,32.61 56.79,31.85 54.38,31.85 52.73,33.5 52.73,37.56 58.95,37.56
GPIO22  (via drill 0.51)  (1 unrouted)
  Top 0.279: 20.98,49.63 26.57,49.63 26.82,49.37 26.82,48.74 27.33,48.23 34.19,48.23 34.19,45.69 31.65,45.69 31.65,43.15 34.19,43.15 34.19,40.61 29.61,40.61 29.61,40.13 29.9,39.85 31.27,39.85 JP6.13
  Top 0.305: v39.01,30.32 v39.01,34.9
  Bottom 0.254: PICAM_SHIELD.P1_15 20.22,48.99 27.2,42.01
  Bottom 0.279: 27.2,42.01 36.47,42.01 36.98,41.5 36.98,39.72 36.73,39.47 36.73,36.93 38.76,34.9 v39.01,34.9
  Bottom 0.305: v41.68,10.64 41.81,10.26 41.81,13.43 40.92,14.32 38.76,14.32 38.25,14.83 38.25,29.56 v39.01,30.32
GPIO27  (via drill 0.5)  (1 unrouted)
  Top 0.279: PICAM_SHIELD.P1_13 17.68,49.5 18.95,48.23 24.03,48.23 24.03,45.69 21.49,45.69 21.49,40.61 21.99,40.61 v22.25,40.36
  Top 0.305: 48.83,3.95 50.32,5.43 50.32,10.89 49.68,11.53 43.71,11.53 40.92,14.32 38.76,14.32 38.25,14.83 38.25,22.07 37.11,23.21 JP8.10 36.98,26.26 41.17,30.45 41.17,35.66 43.08,37.56 JP6.17
  Bottom 0.279: v22.25,40.36 23.11,40.36 24.03,39.44 24.03,28.04 25.3,26.77 33.42,26.77 JP8.10
I2C_SCK  (via drill 0.51)  (2 unrouted)
  Top 0.254: 5.17,38.26 5.23,38.2 JP6.2
  Top 0.279: PICAM_SHIELD.P1_5 7.52,49.32 7.06,48.87 5.61,48.87 5.61,39.98 6.88,39.98 5.17,38.26 4.98,38.07
  Top 0.305: R25.2 42.31,13.69 43.46,12.54 v45.62,12.54 47.27,12.54 47.78,13.05 R16.2
  Bottom 0.279: 9.42,0.73 41.81,0.73 45.62,4.54 v45.62,12.54
  Bottom 0.305: JP6.2 4.34,37.31 4.34,7.72
I2C_SDA  (via drill 0.51)  (4 unrouted)
  Top 0.305: v35.84,32.86 10.95,32.86 v7.9,35.91 | v2.44,33.37 v7.52,33.37 | R17.2 v51.2,21.31 | v40.66,28.93 42.06,30.32 R23.2
  Bottom 0.305: v2.44,33.37 JP6.1 2.44,48.23 PICAM_SHIELD.P1_3 | v7.9,35.91 7.9,33.75 v7.52,33.37 | v51.2,21.31 51.2,24.35 50.06,25.5 44.09,25.5 v40.66,28.93
  other vias: 6.37,13.81 41.93,33.12
I2C_VCC  (1 unrouted)
L1
  pour Top: 62.13,49.63 64.67,49.63 64.67,39.47 63.4,38.2 63.4,36.55 62.38,36.55 62.38,44.29 62.13,44.55
N$1  (1 unrouted)
  Top 0.406: D1.1 73.45,30.98 73.81,31.34 73.81,37.05 74.95,38.2 74.95,38.87 C6.1 R13.1 75.04,40.77
N$2
  Top 0.254: U2.1 47.6,17.8 47.52,17.88
  Top 0.305: 47.52,17.88 46.89,18.51 46.42,18.51 R18.2 46.38,18.51 45.62,18.51 R21.2 C2.1
N$4  (1 unrouted)
  pour Top: 44.98,29.94 44.98,32.48 51.08,32.48 51.08,31.21 50.06,31.21 48.79,29.94 47.65,29.94 47.14,29.43 47.14,28.04 45.74,28.04 45.74,29.18
N$5  (via drill 0.51)
  Top 0.254: U3.9 71.22,44.73 v72.03,44.17 | D4.C 72.79,52.42 v72.16,51.79
  Bottom 0.305: v72.03,44.17 72.03,51.66 v72.16,51.79
N$6
  Top 0.305: U1.12 57.99,35.33 57.68,35.02 57.09,35.02 R7.1
N$7
  Top 0.254: U1.9 57.97,37.26 R9.2
  Top 0.305: R9.2 55.47,36.08 R10.1
N$8
  Top 0.254: U3.14 70,47.85 69.87,47.98 69.11,47.98 68.73,48.36 R12.1
N$9  (via drill 0.51)
  Top 0.406: 68.69,31.05 C5.2 R1.1 69.87,31.17 69.87,32.23 v70,32.36 | v68.86,36.29 Q1.2
  Bottom 0.406: v68.86,36.29 69.75,36.29 70,36.04 v70,32.36
N$10
  Top 0.254: U3.16 68.91,47.29 68.35,47.85 67.08,47.85 66.83,48.1 R4.1
N$11
  Top 0.254: D4.A 73.8,54.31 74.19,54.71 74.61,54.71 R11.2
N$12  (via drill 0.51)
  Top 0.254: D2.C v71.02,51.91 | U3.7 v70,43.02
  Bottom 0.254: v70,43.02 70,43.66 70.89,44.55 70.89,51.79 v71.02,51.91
N$13  (1 unrouted)
  Top 0.254: D2.A 70.14,54.31
N$14
  Top 0.305: C7.2 R6.1 72.63,39.63 73.3,38.96 C6.2 73.3,38.92 73.3,37.82 73.05,37.56 Q1.8
  Top 0.406: Q1.8 Q1.7 70.89,36.29 68.35,33.75 Q1.4
N$15
  Top 0.305: R2.1 67.68,26.26 67.71,26.26 67.84,26.13 65.85,26.13 R3.2
  Top 0.406: 72.92,26.46 D1.2 71.35,28.04 69.75,28.04 | R1.2 69.75,28.04 | 69.75,28.04 69.75,26.51 69.37,26.13 67.88,26.13 R2.1
N$16  (via drill 0.51, 1.1 pad 1.93)
  Top 0.254: U2.10 48.59,23.28 v47.77,24.1 46.51,25.37 R22.2
  Bottom 0.305: v47.77,24.1 47.01,24.1 45.62,22.7 45.62,20.42 42.57,17.37 41.81,17.37 41.04,18.13 v39.52,18.13
N$17  (via drill 1.1 pad 1.93)
  Top 0.305: R26.1 R27.2 40.83,28.17 C18.1 40.19,27.53 39.52,27.53 39.14,27.15 39.14,20.93 39.39,20.67 v39.52,20.67 40.79,20.67 41.42,20.04 R25.1
N$18  (via drill 1.1 pad 1.93)
  other vias: 39.52,10.51
N$19
  Top 0.254: U3.12 71.78,46.58 72.41,47.21 R8.1
N$20
  Top 0.254: R26.2 45.11,24.61 45.11,24.23 45.24,24.1 46.38,24.1 48.18,22.3 U2.11
N$21  (via drill 0.51)
  Top 0.254: C4.1 48.79,24.35 v48.92,24.15 48.99,24.15 U2.9
  Top 0.305: R20.2 44.85,22.2 44.98,22.32 v46.63,22.32
  Bottom 0.254: 48.92,24.1 v48.92,24.15
  Bottom 0.305: v46.63,22.32 47.14,22.32 48.92,24.1
N$22  (via drill 1.1 pad 1.93)
  other vias: 39.52,7.97
N$23  (1 unrouted)
N$24
  Top 0.254: U2.2 48.18,17.14 47.78,16.73 | 47.78,16.73 R16.1 | 47.78,16.73 46.42,16.73 R18.1 | U2.5 49.4,17.27 50.57,16.1 C16.1 51.46,16.31 51.46,18.51 51.42,18.55 R17.1
  Top 0.305: C16.1 50.57,15.34 47.86,15.34 R16.1
N$25  (via drill 1.1 pad 1.93)
  other vias: 39.52,5.43
N$26  (via drill 1.1 pad 1.93)
  other vias: 39.52,2.89
N$27  (via drill 1.1 pad 1.93)
  other vias: 19.2,10.51
N$28  (via drill 1.1 pad 1.93)
  other vias: 39.52,13.05
N$29  (1 unrouted)
N$30
  pour Top (hatched): 6.88,47.72 6.88,41.37 8.15,41.37 8.15,44.55 11.33,41.37 13.23,41.37 13.23,47.72 11.96,47.72 11.96,43.91 8.15,47.72
N$31
  pour Top (hatched): 17.04,47.72 17.04,46.45 19.58,46.45 19.58,41.37 20.85,41.37 20.85,46.45 23.39,46.45 23.39,47.72
N$32
  pour Top (hatched): 27.2,47.72 27.2,41.37 33.55,41.37 33.55,42.64 31.01,42.64 31.01,46.45 33.55,46.45 33.55,47.72
N$34  (1 unrouted)
N$66  (via drill 1.1 pad 1.93)
  other vias: 14.12,18.13
N$67  (via drill 1.1 pad 1.93)
  other vias: 16.66,18.13
N$68  (via drill 1.1 pad 1.93)
  other vias: 19.2,18.13
N$69  (via drill 1.1 pad 1.93)
  other vias: 21.74,18.13
N$72  (via drill 1.1 pad 1.93)
  other vias: 29.36,18.13
N$73  (via drill 1.1 pad 1.93)
  other vias: 31.9,18.13
N$74  (via drill 1.1 pad 1.93)
  other vias: 34.44,18.13
N$75  (via drill 1.1 pad 1.93)
  other vias: 36.98,18.13
N$76  (via drill 1.1 pad 1.93)
  other vias: 14.12,15.59
N$77  (via drill 1.1 pad 1.93)
  other vias: 16.66,15.59
N$78  (via drill 1.1 pad 1.93)
  other vias: 19.2,15.59
N$79  (via drill 1.1 pad 1.93)
  other vias: 21.74,15.59
N$80  (via drill 1.1 pad 1.93)
  other vias: 24.28,15.59
N$81  (via drill 1.1 pad 1.93)
  other vias: 26.82,15.59
N$82  (via drill 1.1 pad 1.93)
  other vias: 29.36,15.59
N$83  (via drill 1.1 pad 1.93)
  other vias: 31.9,15.59
N$84  (via drill 1.1 pad 1.93)
  other vias: 34.44,15.59
N$85  (via drill 1.1 pad 1.93)
  other vias: 36.98,15.59
N$86  (via drill 1.1 pad 1.93)
  other vias: 14.12,13.05
N$87  (via drill 1.1 pad 1.93)
  other vias: 16.66,13.05
N$88  (via drill 1.1 pad 1.93)
  other vias: 19.2,13.05
N$89  (via drill 1.1 pad 1.93)
  other vias: 21.74,13.05
N$90  (via drill 1.1 pad 1.93)
  other vias: 24.28,13.05
N$91  (via drill 1.1 pad 1.93)
  other vias: 26.82,13.05
N$92  (via drill 1.1 pad 1.93)
  other vias: 29.36,13.05
N$93  (via drill 1.1 pad 1.93)
  other vias: 31.9,13.05
N$94  (via drill 1.1 pad 1.93)
  other vias: 34.44,13.05
N$95  (via drill 1.1 pad 1.93)
  other vias: 36.98,13.05
N$96  (via drill 1.1 pad 1.93)
  other vias: 14.12,10.51
N$98  (via drill 1.1 pad 1.93)
  other vias: 16.66,10.51
N$100  (via drill 1.1 pad 1.93)
  other vias: 21.74,10.51
N$101  (via drill 1.1 pad 1.93)
  other vias: 24.28,10.51
N$102  (via drill 1.1 pad 1.93)
  other vias: 26.82,10.51
N$103  (via drill 1.1 pad 1.93)
  other vias: 29.36,10.51
N$104  (via drill 1.1 pad 1.93)
  other vias: 31.9,10.51
N$105  (via drill 1.1 pad 1.93)
  other vias: 34.44,10.51
N$106  (via drill 1.1 pad 1.93)
  other vias: 36.98,10.51
N$107  (via drill 1.1 pad 1.93)
  other vias: 14.12,7.97
N$108  (via drill 1.1 pad 1.93)
  other vias: 16.66,7.97
N$109  (via drill 1.1 pad 1.93)
  other vias: 19.2,7.97
N$110  (via drill 1.1 pad 1.93)
  other vias: 21.74,7.97
N$111  (via drill 1.1 pad 1.93)
  other vias: 24.28,7.97
N$112  (via drill 1.1 pad 1.93)
  other vias: 26.82,7.97
N$113  (via drill 1.1 pad 1.93)
  other vias: 29.36,7.97
N$114  (via drill 1.1 pad 1.93)
  other vias: 31.9,7.97
N$115  (via drill 1.1 pad 1.93)
  other vias: 34.44,7.97
N$116  (via drill 1.1 pad 1.93)
  other vias: 36.98,7.97
N$117  (via drill 1.1 pad 1.93)
  other vias: 14.12,5.43
N$118  (via drill 1.1 pad 1.93)
  other vias: 16.66,5.43
N$119  (via drill 1.1 pad 1.93)
  other vias: 19.2,5.43
N$120  (via drill 1.1 pad 1.93)
  other vias: 21.74,5.43
N$121  (via drill 1.1 pad 1.93)
  other vias: 24.28,5.43
N$122  (via drill 1.1 pad 1.93)
  other vias: 26.82,5.43
N$123  (via drill 1.1 pad 1.93)
  other vias: 29.36,5.43
N$124  (via drill 1.1 pad 1.93)
  other vias: 31.9,5.43
N$125  (via drill 1.1 pad 1.93)
  other vias: 34.44,5.43
N$126  (via drill 1.1 pad 1.93)
  other vias: 36.98,5.43
N$127  (via drill 1.1 pad 1.93)  (14 unrouted)
  other vias: 14.12,2.89 11.58,2.89 9.04,2.89 9.04,5.43 11.58,5.43 11.58,7.97 11.58,10.51 11.58,13.05 11.58,15.59 11.58,18.13 9.04,15.59 9.04,13.05 9.04,7.97 9.04,10.51 9.04,18.13
N$128  (via drill 1.1 pad 1.93)
  other vias: 16.66,2.89
N$129  (via drill 1.1 pad 1.93)
  other vias: 19.2,2.89
N$130  (via drill 1.1 pad 1.93)
  other vias: 21.74,2.89
N$131  (via drill 1.1 pad 1.93)
  other vias: 24.28,2.89
N$132  (via drill 1.1 pad 1.93)
  other vias: 26.82,2.89
N$133  (via drill 1.1 pad 1.93)
  other vias: 29.36,2.89
N$134  (via drill 1.1 pad 1.93)
  other vias: 31.9,2.89
N$135  (via drill 1.1 pad 1.93)
  other vias: 34.44,2.89
N$136  (via drill 1.1 pad 1.93)
  other vias: 36.98,2.89
OLED_CS
  Top 0.279: 36.73,36.55 36.73,39.34 35.46,40.61 35.46,49.5 32.28,49.5 31.65,50.14 31.65,52.04 PICAM_SHIELD.P1_24
  Top 0.305: JP8.4 25.93,27.4 34.82,27.4 36.73,29.31 36.73,36.55
  Bottom 0.305: JP8.4 18.57,26.39 14.25,26.39 12.6,28.04 JP6.5
OLED_DC
  Top 0.305: JP6.16 40.54,30.7 35.96,26.13 29.74,26.13 JP8.6
  Bottom 0.279: PICAM_SHIELD.P1_22 29.11,52.04 29.11,45.69 34.57,45.69 40.54,39.72 JP6.16
OLED_RST
  Top 0.305: JP6.15 38,29.31 35.46,26.77 27.84,26.77 JP8.5
  Bottom 0.279: PICAM_SHIELD.P1_18 24.03,52.04 24.03,46.83 25.68,45.18 34.19,45.18 38,41.37 JP6.15
PIEZO  (1 unrouted)
  Top 0.279: PICAM_SHIELD.P1_12 15.9,53.31 16.41,52.8 17.17,52.04 18.13,52.04 18.95,51.23 18.95,50.26 19.96,49.12 26.31,49.12 26.31,48.48 26.57,48.23 26.57,40.61 29.11,40.61 29.11,39.21 JP6.12
ROT_A  (via drill 0.5, 0.51)  (1 unrouted)
  Top 0.279: v11.33,39.59 11.83,40.1 11.83,40.61 13.87,40.61 13.87,48.23 11.33,48.23 11.33,45.69 9.29,47.72 9.29,47.98 11.33,50.01 11.33,52.42 10.44,53.31 PICAM_SHIELD.P1_8
  Top 0.305: v10.69,26.77 10.69,28.67 v11.33,29.31
  Bottom 0.279: JP6.9 20.85,40.1 11.83,40.1 v11.33,39.59 11.33,36.67 | 10.69,24.86 v10.69,26.77
  Bottom 0.305: 10.69,21.2 10.69,24.86 | v11.33,29.31 11.33,36.67
ROT_B  (via drill 0.51)  (1 unrouted)
  Top 0.279: PICAM_SHIELD.P1_10 13.36,53.31 14.63,52.04 15.64,52.04 16.41,51.28 16.41,50.01 18.18,48.23 16.41,48.23 16.41,45.69 18.95,45.69 18.95,40.61 20.98,40.61 20.98,40.1 21.49,39.59 21.49,36.17 21.61,36.04 v21.49,36.04 25.17,36.04 25.3,36.17 JP6.10
  Top 0.305: v11.96,25.75 20.47,25.75 22.76,28.04 v22.76,29.31
  Bottom 0.305: 11.96,20.47 v11.96,25.75 | v22.76,29.31 22.76,35.66 21.87,35.66 arc-90 v21.49,36.04
ROT_SW  (via drill 0.61)  (1 unrouted)
  Top 0.279: 14.5,50.77 12.6,48.87 14.5,48.87 14.5,47.6 14.76,47.6 v15.39,48.23
  Bottom 0.254: 8.79,36.67 8.79,41.63 v15.39,48.23 19.07,44.55 23.39,44.55 27.84,40.1 JP6.11
  Bottom 0.279: v15.39,48.23 15.39,50.39 PICAM_SHIELD.P1_11
  Bottom 0.305: 8.79,21.29 8.79,36.67
SD_CS  (via drill 0.51)
  Top 0.279: JP8.3 24.66,28.67 v32.92,28.67
  Bottom 0.279: PICAM_SHIELD.P1_26 32.92,52.55 31.65,51.28 31.65,49.5 41.68,39.47 41.68,36.17 39.27,33.75 37.36,33.75
  Bottom 0.305: JP6.4 10.06,29.31 13.87,25.5 16.91,25.5 JP8.3 | v32.92,28.67 34.19,29.94 34.19,33.12 34.82,33.75 37.36,33.75
SHUTDOWN  (via drill 0.5, 0.51)  (1 unrouted)
  Top 0.279: PICAM_SHIELD.P1_7 10.06,49.5 8.79,48.23 6.25,48.23 6.25,40.61 8.79,40.61 8.79,43.15 11.33,40.61 9.93,40.61 JP6.3
  Top 0.305: v65.43,29.18 65.43,28.25 | v34.95,32.1 10.44,32.1 7.01,35.53 7.01,37.69 JP6.3
  Bottom 0.305: v65.43,29.18 55.27,29.18 49.43,35.02 49.43,39.72 48.92,40.23 47.14,40.23 46.76,39.85 46.76,35.28 43.58,32.1 v34.95,32.1
SPI_MISO  (via drill 0.5, 0.51)
  Top 0.279: v25.04,46.96 24.66,46.96 24.66,45.06 22.12,45.06 22.12,41.25 v22.5,41.63 | v15.14,43.79 14.5,43.79 14.5,39.98 13.23,39.98 13.23,39.85 JP6.6
  Top 0.305: v20.98,28.67 v15.14,28.67
  Bottom 0.279: v22.5,41.63 17.3,41.63 v15.14,43.79
  Bottom 0.305: v15.14,28.67 JP6.6 | JP8.9 31.52,26.13 24.66,26.13 22.12,28.67 v20.98,28.67 | v25.04,46.96 25.8,46.96 27.84,48.99 PICAM_SHIELD.P1_21
SPI_MOSI  (via drill 0.5, 0.51)
  Top 0.279: v25.3,48.23 25.93,47.6 25.93,40.61 25.3,40.61 v24.66,41.25 | v17.68,43.15 18.31,43.15 18.31,39.98 18.95,39.98 18.95,39.47 JP6.7
  Top 0.305: v20.98,27.4 v17.68,27.4
  Bottom 0.279: PICAM_SHIELD.P1_19 v25.3,48.23 | v24.66,41.25 24.03,41.25 22.12,43.15 v17.68,43.15
  Bottom 0.305: JP8.8 31.9,23.34 29.74,25.5 22.88,25.5 v20.98,27.4 | v17.68,27.4 JP6.7
SPI_SCLK
  Top 0.279: PICAM_SHIELD.P1_23 32.28,48.87 34.82,48.87 34.82,45.06 32.28,45.06 32.28,43.79 34.82,43.79 34.82,39.98 34.19,39.98 34.19,37.05
  Top 0.305: JP6.8 20.22,35.66 20.85,35.02 32.92,35.02 34.19,36.29 34.19,37.05
  Bottom 0.305: JP6.8 20.22,26.13 21.49,24.86 27.71,24.86 JP8.7
SRN
  Top 0.254: U2.8 49.4,22.55 50.82,23.97 C12.1
  Top 0.305: C14.1 51.71,25.41 | 51.71,25.41 C12.1 | 51.71,25.41 51.84,25.54 51.84,27.66 52.64,28.46 R19.1
SRP  (3 unrouted)
  Top 0.254: 49.99,21.76 U2.7
  Top 0.305: 50.56,21.76 49.99,21.76
TS  (4 unrouted)
  Top 0.254: U3.1 66.7,46.58 65.94,47.34
TS_GAUGE  (1 unrouted)
  Top 0.305: R21.1 44.35,20.8 42.57,22.58 R20.1
VBAT  (via drill 0.51, 0.58)  (2 unrouted)
  Top 0.254: U2.4 U2.3 48.74,17.8 48.79,17.75 | U3.2 U3.3 67.59,45.56 | 66.57,44.55 66.57,39.47 64.54,37.44 64.54,28.29 v64.16,27.91 | 68.22,46.07 67.21,46.07
  Top 0.305: 48.79,17.75 v48.79,16.73 | C13.1 52.51,14.16 51.97,14.7 51.97,15.34 v51.71,15.59
  Bottom 0.305: v51.71,15.59 49.93,15.59 v48.79,16.73 51.97,19.91 51.97,24.23 55.65,27.91 v64.16,27.91
  Bottom 0.914: 67.46,54.2 66.83,53.56 v66.83,45.69 66.83,44.55
  other vias: 66.83,44.67
  pour Top: 66.44,46.07 68.35,46.07 68.35,45.56 67.59,45.56 67.59,44.42 67.33,44.17 66.44,44.17
VBAT_NEG  (2 unrouted)
VBAT_SW  (via drill 0.51, 0.58, 1.1 pad 1.93)
  Top 0.254: 72.29,33.63 Q1.5
  Top 0.305: U1.11 58.01,35.96 v57.94,36.04
  Top 0.406: U1.8 59.89,38.27
  Top 0.914: C5.1 66.74,29.35 66.32,29.82 66.32,32.48 v67.46,32.48 v68.48,32.48 70.38,34.39
  Top 1.016: C5.1 R2.2 | L1.P$2 L1.P$1 54.51,45.79
  Bottom 0.305: v57.94,36.04 57.94,34.9 58.44,34.39 63.02,34.39
  Bottom 0.61: v39.52,15.59 46.63,15.59 48.16,14.07 53.24,14.07 53.87,14.7 53.87,24.86 55.01,26.01 67.46,26.01 67.84,26.39 67.84,32.1 v67.46,32.48
  Bottom 1.016: v57.94,39.34 v57.94,38.2 62.63,38.2 63.02,37.82 63.02,34.39 63.02,34.13 64.67,32.48 v67.46,32.48 v68.48,32.48
  pour Top (no thermals): 70.38,35.15 73.05,35.15 73.05,33.63 70.38,33.63 70,34.01 70,34.77
  pour Top: 53.24,46.33 56.03,46.33 57.05,45.31 57.05,42.26 59.97,39.34 59.97,37.94 57.81,37.94 57.43,37.56 56.41,37.56 55.14,38.83 54,38.83 53.87,38.96 53.87,43.53 53.24,44.17

### Text on the board
tNames: +BAT- | CHARGE: | OK | ++ | CHARGE | +5V- | ON/ | OFF | Call me Otto. | * | SDA | SCK | GP04 | GP07 | GP08 | MISO | MOSI | SCLK | GP14 | GP15 | GP17 | GP18 | GP22 | GP23 | GP24 | GP25 | GP27 | GND | 3.3V | 5V | BTN | - | + | CE1 | CE0 | 24 | 25 | SCK | SI | SO | 27 | SPI | ROT | SCL | SDA | * | BATSW | I²C
bNames: SDA | SCK | GP04 | GP07 | GP08 | MISO | MOSI | SCLK | GP14 | GP15 | GP17 | GP18 | GP22 | GP23 | GP24 | GP25 | GP27 | GND | 3.3V | 5V | GND | 23 | GND | 5V/3V | CE1 | CE0 | 24 | 25 | SCK | SI | SO | 27 | GND | 17 | 14 | 15 | GND | 5V | SDA | SCK